# Altium schematic sheet Top Level.SchDoc
size A4
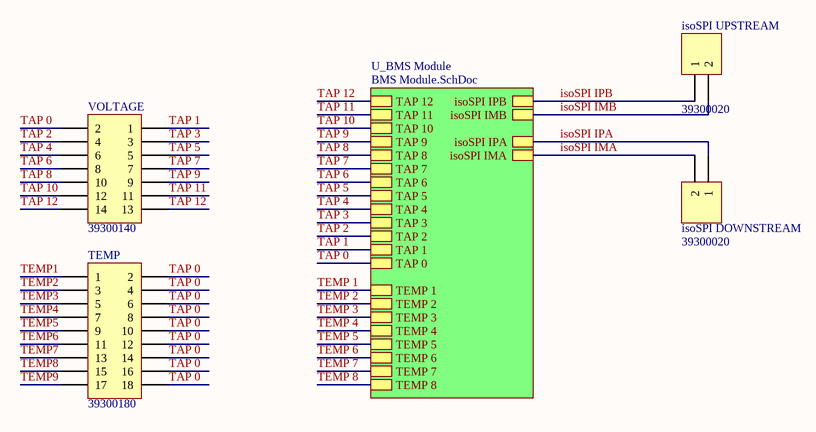
[diagram p0: Top Level.SchDoc]

## Parts
isoSPI_DOWNSTREAM  39300020  [39300020]
isoSPI_UPSTREAM  39300020  [39300020]
TEMP  39300180  [39300180]
VOLTAGE  39300140  [39300140]

## Sub-sheets
U_BMS Module = BMS Module.SchDoc: isoSPI IPB, isoSPI IMB, TEMP 1, TEMP 2, TEMP 3, TEMP 4, TEMP 5, TEMP 6, TEMP 7, TEMP 8, TAP 0, TAP 1, TAP 2, TAP 3, TAP 4, TAP 5, TAP 6, TAP 7, TAP 8, TAP 9, TAP 10, TAP 11, TAP 12, isoSPI IPA, isoSPI IMA

## Nets
isoSPI IMA: isoSPI_DOWNSTREAM.2 ; sheet U_BMS Module/isoSPI IMA
isoSPI IMB: isoSPI_UPSTREAM.2 ; sheet U_BMS Module/isoSPI IMB
isoSPI IPA: isoSPI_DOWNSTREAM.1 ; sheet U_BMS Module/isoSPI IPA
isoSPI IPB: isoSPI_UPSTREAM.1 ; sheet U_BMS Module/isoSPI IPB
TAP 0: TEMP.2 TEMP.4 TEMP.6 TEMP.8 TEMP.10 TEMP.12 TEMP.14 TEMP.16 TEMP.18 VOLTAGE.2 ; sheet U_BMS Module/TAP 0
TAP 1: VOLTAGE.1 ; sheet U_BMS Module/TAP 1
TAP 2: VOLTAGE.4 ; sheet U_BMS Module/TAP 2
TAP 3: VOLTAGE.3 ; sheet U_BMS Module/TAP 3
TAP 4: VOLTAGE.6 ; sheet U_BMS Module/TAP 4
TAP 5: VOLTAGE.5 ; sheet U_BMS Module/TAP 5
TAP 6: VOLTAGE.8 ; sheet U_BMS Module/TAP 6
TAP 7: VOLTAGE.7 ; sheet U_BMS Module/TAP 7
TAP 8: VOLTAGE.10 ; sheet U_BMS Module/TAP 8
TAP 9: VOLTAGE.9 ; sheet U_BMS Module/TAP 9
TAP 10: VOLTAGE.12 ; sheet U_BMS Module/TAP 10
TAP 11: VOLTAGE.11 ; sheet U_BMS Module/TAP 11
TAP 12: VOLTAGE.13 VOLTAGE.14 ; sheet U_BMS Module/TAP 12
TEMP1: TEMP.1
TEMP2: TEMP.3
TEMP3: TEMP.5
TEMP4: TEMP.7
TEMP5: TEMP.9
TEMP6: TEMP.11
TEMP7: TEMP.13
TEMP8: TEMP.15
TEMP9: TEMP.17
TEMP 1: sheet U_BMS Module/TEMP 1
TEMP 2: sheet U_BMS Module/TEMP 2
TEMP 3: sheet U_BMS Module/TEMP 3
TEMP 4: sheet U_BMS Module/TEMP 4
TEMP 5: sheet U_BMS Module/TEMP 5
TEMP 6: sheet U_BMS Module/TEMP 6
TEMP 7: sheet U_BMS Module/TEMP 7
TEMP 8: sheet U_BMS Module/TEMP 8

## Library data of the parts
isoSPI_DOWNSTREAM isoSPI_UPSTREAM = 39300020: Positions: 2; Pitch: 4.2mm; Row Spacing: 5.5mm; Angle: 90; Flange: No; Contact: Tin; Part Number: 39300020; Digikey Part Number: WM21351-ND
TEMP = 39300180: Positions: 18; Pitch: 4.2mm; Row Spacing: 5.5mm; Angle: 90; Flange: No; Contact: Tin; Part Number: 39300180; Digikey Part Number: WM21359-ND
VOLTAGE = 39300140: Positions: 14; Pitch: 4.2mm; Row Spacing: 5.5mm; Angle: 90; Flange: No; Contact: Tin; Part Number: 39300140; Digikey Part Number: WM21357-ND